# Altium schematic sheet main_ftdi.SchDoc: SDL - Main
size Letter; Author: Ye-Sheng Kuo; Revision: 1; SheetNumber: 5; SheetTotal: 8
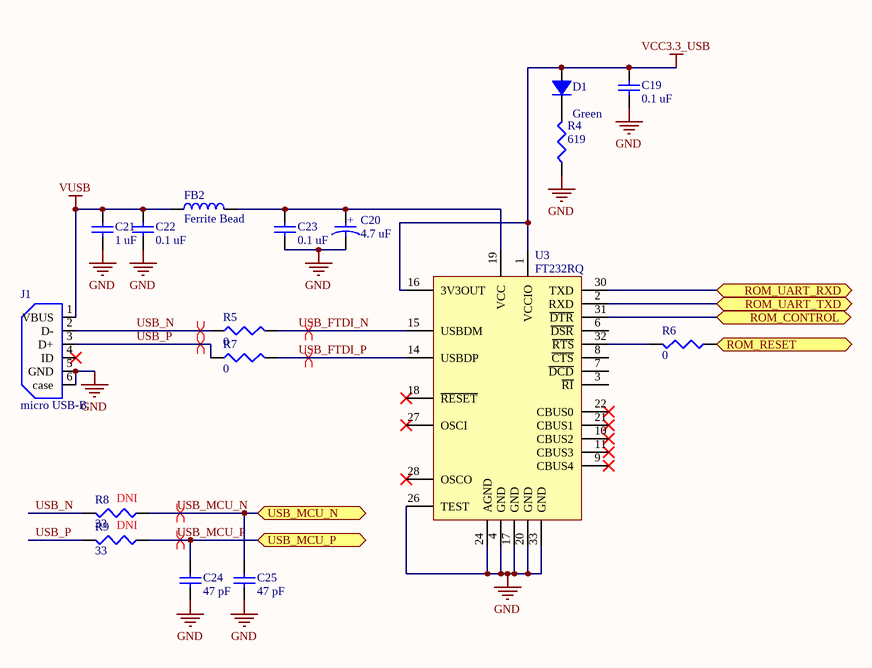
[diagram p0: main_ftdi.SchDoc]

## Parts
C19  value 0.1 uF  [0402]  (hidden comment: Ceramic capacitor)
C20  value 4.7 uF  [0603 - Polar Marking]  (hidden comment: Tantalum capacitor)
C21  value 1 uF  [0402]  (hidden comment: Ceramic capacitor)
C22  value 0.1 uF  [0402]  (hidden comment: Ceramic capacitor)
C23  value 0.1 uF  [0402]  (hidden comment: Ceramic capacitor)
C24  value 47 pF  [0402]  (hidden comment: Ceramic capacitor)
C25  value 47 pF  [0402]  (hidden comment: Ceramic capacitor)
D1  Color: Green  [0402 - DIODE]  (hidden comment: LED, Green)
FB2  Ferrite Bead  [0402]
J1  micro USB-B  [Micro USB-B]
R4  value 619  [0402]  (hidden comment: Chip resistor)
R5  value 0  [0402]  (hidden comment: Chip resistor)
R6  value 0  [0402]  (hidden comment: Chip resistor)
R7  value 0  [0402]  (hidden comment: Chip resistor)
R8  value 33  [0402]  (hidden comment: Chip resistor)
R9  value 33  [0402]  (hidden comment: Chip resistor)
U3  FT232RQ  [QFN-32]

## Ports
ROM_CONTROL, ROM_RESET, ROM_UART_RXD, ROM_UART_TXD, USB_MCU_N, USB_MCU_P

## Nets
GND: C19.2 C20.2 C21.2 C22.2 C23.2 C24.2 C25.2 J1.5(GND) J1.6(case) R4.2 U3.4(GND) U3.17(GND) U3.20(GND) U3.24(AGND) U3.26(TEST) U3.33(GND)
VCC3.3_USB: C19.1 D1.1 U3.1(VCCIO) U3.16(3V3OUT)
VUSB: C21.1 C22.1 FB2.2 J1.1(VBUS)
ROM_CONTROL: U3.31(~{DTR}) ; port ROM_CONTROL
ROM_RESET: R6.2 ; port ROM_RESET
ROM_UART_RXD: U3.30(TXD) ; port ROM_UART_RXD
ROM_UART_TXD: U3.2(RXD) ; port ROM_UART_TXD
USB_FTDI_N: R5.1 U3.15(USBDM)
USB_FTDI_P: R7.1 U3.14(USBDP)
USB_MCU_N: C25.1 R8.2 ; port USB_MCU_N
USB_MCU_P: C24.1 R9.2 ; port USB_MCU_P
USB_N: J1.2(D-) R5.2 R8.1
USB_P: J1.3(D+) R7.2 R9.1
NetC20_1: C20.1 C23.1 FB2.1 U3.19(VCC)
NetD1_2: D1.2 R4.1
NetR6_1: R6.1 U3.32(~{RTS})

Not connected (* = marked no-connect by the designer): J1 4(ID)*; U3 3(~{RI}) 6(~{DSR}) 7(~{DCD}) 8(~{CTS}) 9(CBUS4)* 10(CBUS2)* 11(CBUS3)* 18(~{RESET})* 21(CBUS1)* 22(CBUS0)* 27(OSCI)* 28(OSCO)*

## Layout directives
differential pair: USB_FTDI_N, USB_FTDI_P, USB_MCU_N, USB_MCU_P, USB_N, USB_P

## Notes on the sheet
- (near R8) DNI
- DNI
- Title
- Date:
- Author:
- Revision:
- Sheet
- of
- University of Michigan
- File:
- (in symbol C_4.7u_0603_tantalum) +

## Library data of the parts
C19 C22 C23 = C_0.1u_0402_ceramic: Ceramic capacitor, 0.1u, 0402 package; Manufacture: TDK; voltage rated: 10 V; tolerance: 10%; Supplier 1: Digi-Key; Supplier Part Number 1: 445-1265-1-ND; package: 0402
C20 = C_4.7u_0603_tantalum: Tantalum capacitor, 4.7 uF, 0603 package; Manufacture: Rohm; voltage rated: 10 V; tolerance: 20%; package: 0603; Supplier 1: Digi-Key; Supplier Part Number 1: 511-1496-1-ND
C21 = C_1u_0402_ceramic: Ceramic capacitor, 1 uF, 0402 package; Manufacture: TDK; voltage rated: 6.3 V; tolerance: 10%; package: 0402; Supplier 1: Digi-Key; Supplier Part Number 1: 445-5000-1-ND
C24 C25 = C_47p_0402_ceramic: Ceramic capacitor, 47 pF, 0402 package; Manufacture: Johanson; voltage rated: 50 V; tolerance: 5%; package: 0402; Supplier 1: Digi-Key; Supplier Part Number 1: 709-1121-1-ND
D1 = D_LED_GREEN_0402: LED, Green,  0402; package: 0402; Supplier 1: Digi-Key; Supplier Part Number 1: 511-1592-1-ND
FB2 = FB_150mA_0402: Ferrite Bead, 150 mA, 0402 package; impedance@Freq: 1K@100 MHz; current rating: 150 mA; Supplier 1: Digi-Key; Supplier Part Number 1: 587-1835-1-ND; package: 0402
J1 = Micro USB: CONN USB MICRO B RECPT SMT R/A; Supplier 1: Digi-Key; Supplier Part Number 1: 609-4616-6-ND
R4 = R_619_0402: Chip resistor, 619, 0402 package; tolerance: 1%; power: 1/16 W; package: 0402; Supplier 1: Digi-Key; Supplier Part Number 1: 541-619LCT-ND
R5-R7 = R_0_0402: Chip resistor, 0, 0402 package; package: 0402; Supplier 1: Digi-Key; Supplier Part Number 1: 541-0.0YBCT-ND
R8 R9 = R_33_0402: Chip resistor, 33, 0402 package; tolerance: 1%; power: 1/16 W; package: 0402; Supplier 1: Digi-Key; Supplier Part Number 1: 541-33.0LCT-ND
U3 = FT232RQ: FT232R USB UART; Manufacturer: *; Note: *; ManufacturerPartNo: *; Supplier 1: Digi-Key; Supplier Part Number 1: 768-1008-1-ND